# Altium schematic sheet TUSB8041_Misc_2.SchDoc
size 386 x 246 mm; SheetNumber: 2; SheetTotal: 3
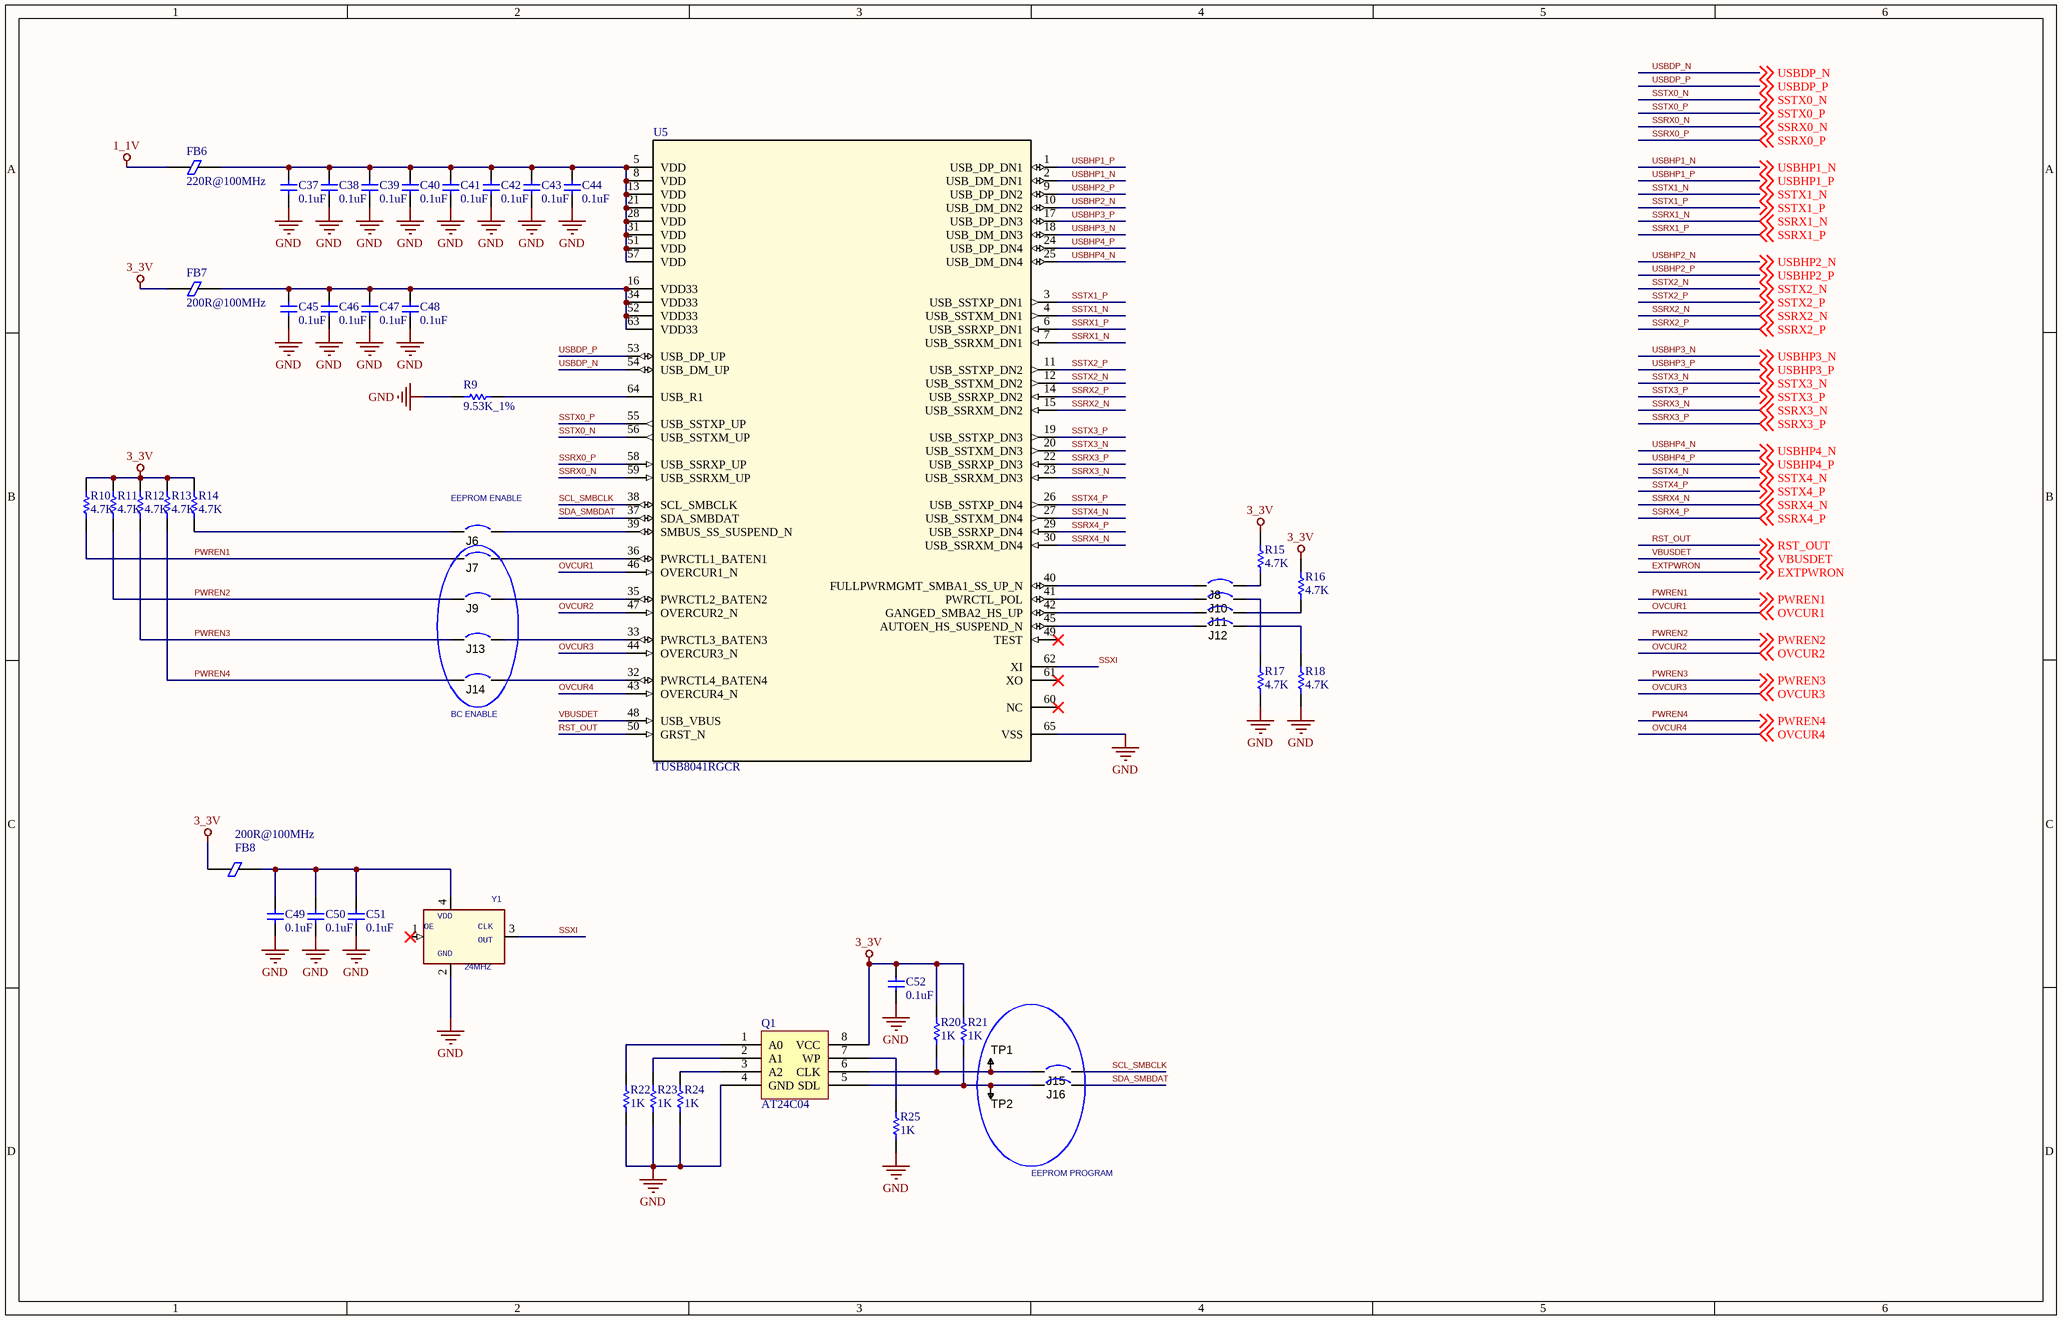
[diagram p0: TUSB8041_Misc_2.SchDoc]

## Parts
C37  0.1uF  [CAP0402]
C38  0.1uF  [CAP0402]
C39  0.1uF  [CAP0402]
C40  0.1uF  [CAP0402]
C41  0.1uF  [CAP0402]
C42  0.1uF  [CAP0402]
C43  0.1uF  [CAP0402]
C44  0.1uF  [CAP0402]
C45  0.1uF  [CAP0402]
C46  0.1uF  [CAP0402]
C47  0.1uF  [CAP0402]
C48  0.1uF  [CAP0402]
C49  0.1uF  [CAP0603]
C50  0.1uF  [CAP0603]
C51  0.1uF  [CAP0603]
C52  0.1uF  [CAP0603]
FB6  220R@100MHz  [L0603]
FB7  200R@100MHz  [L0603]
FB8  200R@100MHz  [L0603]
J6  JUMPER  [JP]  (value not drawn)
J7  JUMPER  [JP]  (value not drawn)
J8  JUMPER  [JP]  (value not drawn)
J9  JUMPER  [JP]  (value not drawn)
J10  JUMPER  [JP]  (value not drawn)
J11  JUMPER  [JP]  (value not drawn)
J12  JUMPER  [JP]  (value not drawn)
J13  JUMPER  [JP]  (value not drawn)
J14  JUMPER  [JP]  (value not drawn)
J15  JUMPER  [JP]  (value not drawn)
J16  JUMPER  [JP]  (value not drawn)
Q1  AT24C04  [SOIC-8]
R9  9.53K_1%  [RES0603]
R10  4.7K  [RES0603]
R11  4.7K  [RES0603]
R12  4.7K  [RES0603]
R13  4.7K  [RES0603]
R14  4.7K  [RES0603]
R15  4.7K  [RES0603]
R16  4.7K  [RES0603]
R17  4.7K  [RES0603]
R18  4.7K  [RES0603]
R20  1K  [RES0603]
R21  1K  [RES0603]
R22  1K  [RES0603]
R23  1K  [RES0603]
R24  1K  [RES0603]
R25  1K  [RES0603]
TP1  TESTPOINT_THT_MINI  [TP]  (value not drawn)
TP2  TESTPOINT_THT_MINI  [TP]  (value not drawn)
U5  TUSB8041RGCR  [QFN64_9*9]
Y1  24MHZ  [XTAL-3225]

## Nets
1_1V: FB6.2
3_3V: C52.2 FB7.2 FB8.2 Q1.8(VCC) R10.2 R11.2 R12.2 R13.2 R14.2 R15.2 R16.2 R20.2 R21.2
GND: C37.1 C38.1 C39.1 C40.1 C41.1 C42.1 C43.1 C44.1 C45.1 C46.1 C47.1 C48.1 C49.1 C50.1 C51.1 C52.1 Q1.4(GND) R9.2 R17.1 R18.1 R22.1 R23.1 R24.1 R25.1 U5.65(VSS) Y1.2(GND)
OVCUR1: U5.46(OVERCUR1_N) ; off-sheet OVCUR1
OVCUR2: U5.47(OVERCUR2_N) ; off-sheet OVCUR2
OVCUR3: U5.44(OVERCUR3_N) ; off-sheet OVCUR3
OVCUR4: U5.43(OVERCUR4_N) ; off-sheet OVCUR4
PWREN1: J7.1 R10.1 ; off-sheet PWREN1
PWREN2: J9.1 R11.1 ; off-sheet PWREN2
PWREN3: J13.1 R12.1 ; off-sheet PWREN3
PWREN4: J14.1 R13.1 ; off-sheet PWREN4
RST_OUT: U5.50(GRST_N) ; off-sheet RST_OUT
SCL_SMBCLK: J15.2 U5.38(SCL_SMBCLK)
SDA_SMBDAT: J16.2 U5.37(SDA_SMBDAT)
SSRX0_N: U5.59(USB_SSRXM_UP) ; off-sheet SSRX0_N
SSRX0_P: U5.58(USB_SSRXP_UP) ; off-sheet SSRX0_P
SSRX1_N: U5.7(USB_SSRXM_DN1) ; off-sheet SSRX1_N
SSRX1_P: U5.6(USB_SSRXP_DN1) ; off-sheet SSRX1_P
SSRX2_N: U5.15(USB_SSRXM_DN2) ; off-sheet SSRX2_N
SSRX2_P: U5.14(USB_SSRXP_DN2) ; off-sheet SSRX2_P
SSRX3_N: U5.23(USB_SSRXM_DN3) ; off-sheet SSRX3_N
SSRX3_P: U5.22(USB_SSRXP_DN3) ; off-sheet SSRX3_P
SSRX4_N: U5.30(USB_SSRXM_DN4) ; off-sheet SSRX4_N
SSRX4_P: U5.29(USB_SSRXP_DN4) ; off-sheet SSRX4_P
SSTX0_N: U5.56(USB_SSTXM_UP) ; off-sheet SSTX0_N
SSTX0_P: U5.55(USB_SSTXP_UP) ; off-sheet SSTX0_P
SSTX1_N: U5.4(USB_SSTXM_DN1) ; off-sheet SSTX1_N
SSTX1_P: U5.3(USB_SSTXP_DN1) ; off-sheet SSTX1_P
SSTX2_N: U5.12(USB_SSTXM_DN2) ; off-sheet SSTX2_N
SSTX2_P: U5.11(USB_SSTXP_DN2) ; off-sheet SSTX2_P
SSTX3_N: U5.20(USB_SSTXM_DN3) ; off-sheet SSTX3_N
SSTX3_P: U5.19(USB_SSTXP_DN3) ; off-sheet SSTX3_P
SSTX4_N: U5.27(USB_SSTXM_DN4) ; off-sheet SSTX4_N
SSTX4_P: U5.26(USB_SSTXP_DN4) ; off-sheet SSTX4_P
SSXI: U5.62(XI) Y1.3(CLKOUT)
USBDP_N: U5.54(USB_DM_UP) ; off-sheet USBDP_N
USBDP_P: U5.53(USB_DP_UP) ; off-sheet USBDP_P
USBHP1_N: U5.2(USB_DM_DN1) ; off-sheet USBHP1_N
USBHP1_P: U5.1(USB_DP_DN1) ; off-sheet USBHP1_P
USBHP2_N: U5.10(USB_DM_DN2) ; off-sheet USBHP2_N
USBHP2_P: U5.9(USB_DP_DN2) ; off-sheet USBHP2_P
USBHP3_N: U5.18(USB_DM_DN3) ; off-sheet USBHP3_N
USBHP3_P: U5.17(USB_DP_DN3) ; off-sheet USBHP3_P
USBHP4_N: U5.25(USB_DM_DN4) ; off-sheet USBHP4_N
USBHP4_P: U5.24(USB_DP_DN4) ; off-sheet USBHP4_P
VBUSDET: U5.48(USB_VBUS) ; off-sheet VBUSDET
NetC37_2: C37.2 C38.2 C39.2 C40.2 C41.2 C42.2 C43.2 C44.2 FB6.1 U5.5(VDD) U5.8(VDD) U5.13(VDD) U5.21(VDD) U5.28(VDD) U5.31(VDD) U5.51(VDD) U5.57(VDD)
NetC45_2: C45.2 C46.2 C47.2 C48.2 FB7.1 U5.16(VDD33) U5.34(VDD33) U5.52(VDD33) U5.63(VDD33)
NetC49_2: C49.2 C50.2 C51.2 FB8.1 Y1.4(VDD)
NetJ6_1: J6.1 R14.1
NetJ6_2: J6.2 U5.39(SMBUS_SS_SUSPEND_N)
NetJ7_2: J7.2 U5.36(PWRCTL1_BATEN1)
NetJ8_1: J8.1 U5.40(FULLPWRMGMT_SMBA1_SS_UP_N)
NetJ8_2: J8.2 R15.1
NetJ9_2: J9.2 U5.35(PWRCTL2_BATEN2)
NetJ10_1: J10.1 U5.41(PWRCTL_POL)
NetJ10_2: J10.2 R17.2
NetJ11_1: J11.1 U5.42(GANGED_SMBA2_HS_UP)
NetJ11_2: J11.2 R16.1
NetJ12_1: J12.1 U5.45(AUTOEN_HS_SUSPEND_N)
NetJ12_2: J12.2 R18.2
NetJ13_2: J13.2 U5.33(PWRCTL3_BATEN3)
NetJ14_2: J14.2 U5.32(PWRCTL4_BATEN4)
NetJ15_1: J15.1 Q1.6(CLK) R20.1 TP1.1
NetJ16_1: J16.1 Q1.5(SDL) R21.1 TP2.1
NetQ1_1: Q1.1(A0) R22.2
NetQ1_2: Q1.2(A1) R23.2
NetQ1_3: Q1.3(A2) R24.2
NetQ1_7: Q1.7(WP) R25.2
NetR9_1: R9.1 U5.64(USB_R1)

Not connected (* = marked no-connect by the designer): U5 49(TEST)* 60(NC)* 61(XO)*; Y1 1(OE)*

## Notes on the sheet
- (near J6) EEPROM ENABLE
- (near J14) BC ENABLE
- EEPROM PROGRAM
- (in symbol XTAL) CLK; OUT

## Library data of the parts
C37-C52 = CAP: Capacitor; Value: 104; Published: 8-Jun-2000; LatestRevisionDate: 17-Jul-2002; LatestRevisionNote: Re-released for DXP Platform.; PackageReference: RAD-0.3; Publisher: Altium Limited
FB6-FB8 = Ferrite Bead
J6-J16 = JUMPER: Manufacturer: Used in BOM report; SymbolVersion: use current date i.e. 2008-05-20; SymbolCreator: Use a-id; CompType: Used in some BOM reports.  Useful for finding later.; U/M: EA, IN, or GM; MountType: SMT, TH, or N/A; RoHS: Used in BOM report.  Use Y or N.; PartNumber: Used in BOM report; PackageReference: N/A; ComponentLink1Description: Datasheet Link; Alternate PartNumber: -; Alternate Manufacturer: -
Q1 = AT24C04: I2C-Compatible, (2-wire) Serial EEPROM / 4-Kbit (512 x 8)
R9-R18 = RES: Resistor; Value: 1K; Published: 8-Jun-2000; Revision: July-2002: Re-released for DXP Platform.; Publisher: Altium Limited
R20-R25 = RES: Resistor; Published: 8-Jun-2000; Revision: July-2002: Re-released for DXP Platform.; Publisher: Altium Limited; Value: 1K
TP1 TP2 = TESTPOINT_THT_MINI: Test Point; Manufacturer 1: Keystone Electronics; Manufacturer Part Number 1: 5002; Mounting Type: 0.040" (1.0mm) Hole Diameter; Material: Base, Nylon 46, UL 94V-0; Supplier 1: Digi-Key; Supplier Part Number 1: 5002K-ND
U5 = TUSB8041RGCR: USB30HUB; Alternate PartNumber: TUSB8041RGCT; Manufacturer: Texas Instruments; CompType: IC; PIN_COUNT: 65; Application_BuildNumber: *; PartNumber: TUSB8041RGCR; PackageReference: RGC0064G; MountType: SMT; RoHS: Y; RefDes: RefDes; Type: TYPE; Value: Value
Y1 = XTAL: OSC 50MHZ FIXED 3.3V SMT; CLASS: IC; CAD_APPROVED: Yes; MFG_PN01: ECS-3953M-500-BN; MFG_NAME01: ECS INC. INTERNATIONAL; AGILE_PN: 230-76894; HEIGHT: 1.75MM; ROHS: Yes